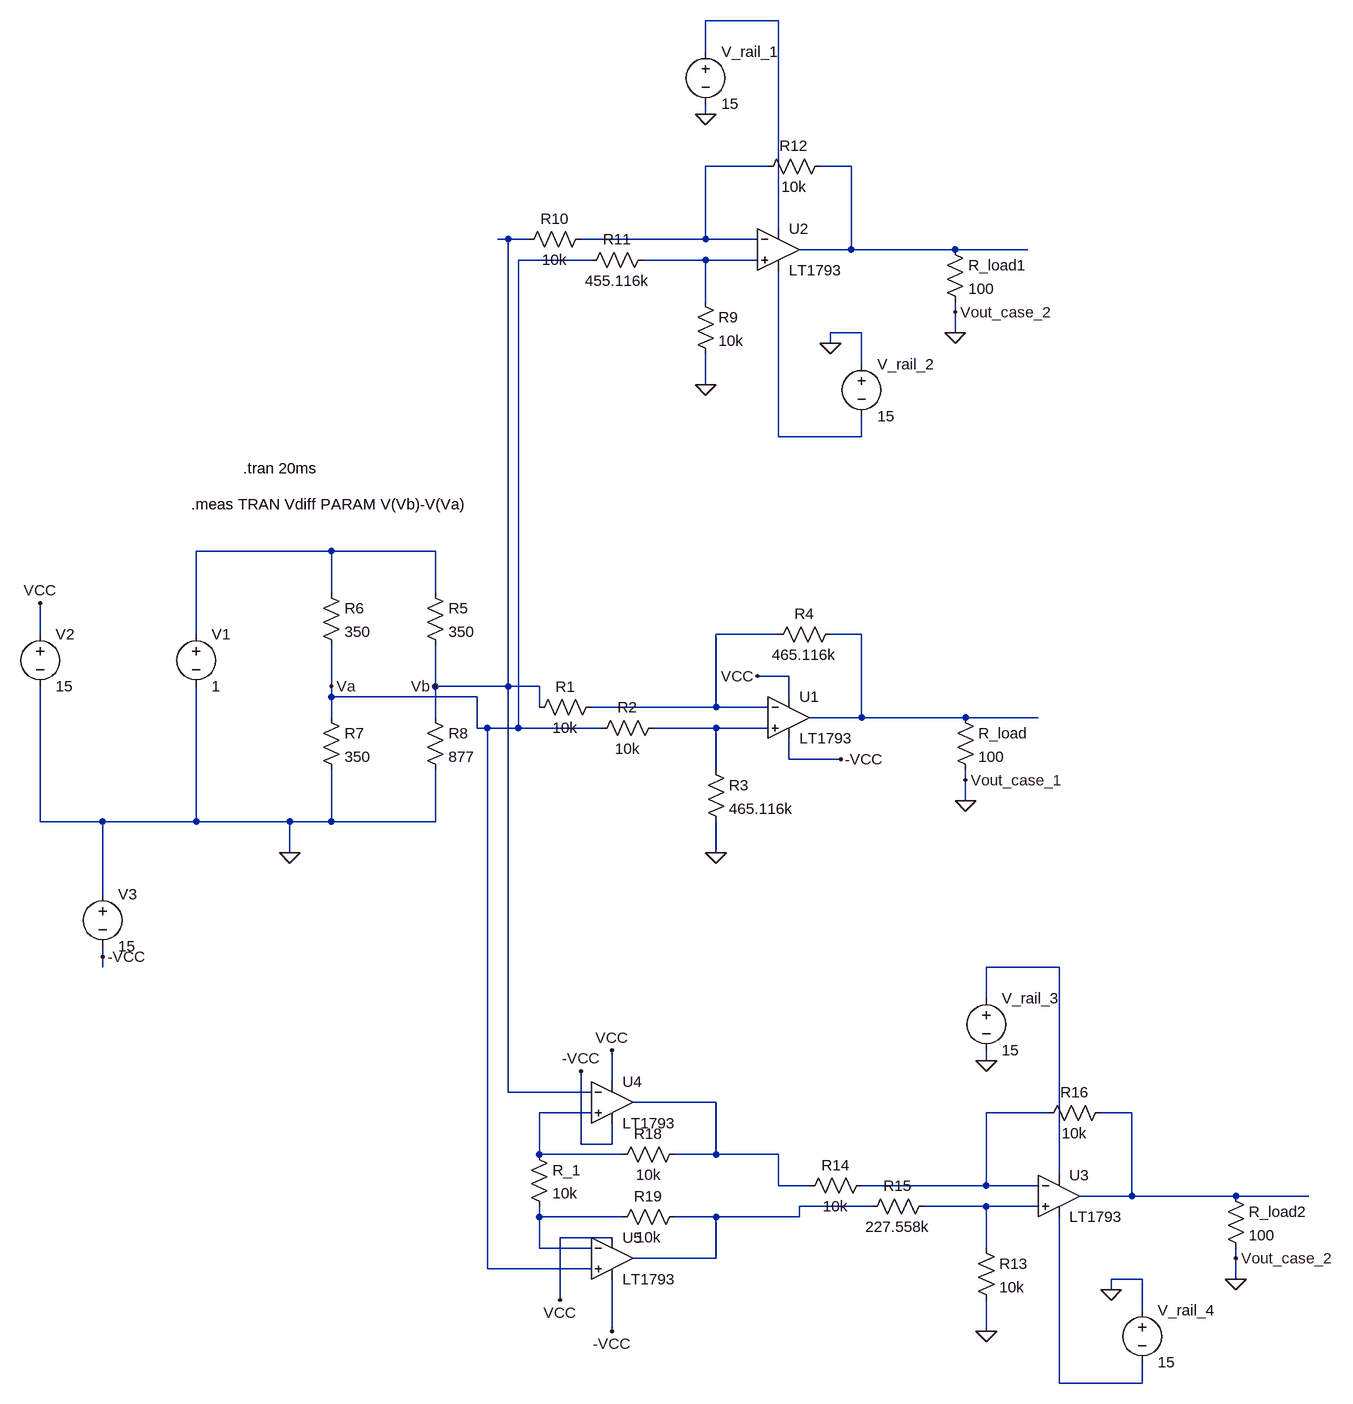
[diagram p0: schematic hw02_ece6140_B.asc]
hw02_ece6140_B.asc, the LTspice schematic file:
Version 4.1
SHEET 1 1000 1204
WIRE 176 -912 64 -912
WIRE 64 -864 64 -912
WIRE 64 -768 64 -784
WIRE 160 -688 64 -688
WIRE 288 -688 240 -688
WIRE 176 -592 176 -912
WIRE -240 -576 -256 -576
WIRE -208 -576 -240 -576
WIRE 64 -576 64 -688
WIRE 64 -576 -128 -576
WIRE 144 -576 64 -576
WIRE 288 -560 288 -688
WIRE 288 -560 208 -560
WIRE 448 -560 288 -560
WIRE 560 -560 448 -560
WIRE -112 -544 -224 -544
WIRE 64 -544 -32 -544
WIRE 144 -544 64 -544
WIRE 64 -480 64 -544
WIRE 448 -464 448 -480
WIRE 304 -432 256 -432
WIRE 448 -432 448 -464
WIRE 256 -416 256 -432
WIRE 304 -384 304 -432
WIRE 64 -352 64 -400
WIRE 176 -272 176 -528
WIRE 304 -272 304 -304
WIRE 304 -272 176 -272
WIRE -512 -96 -720 -96
WIRE -352 -96 -512 -96
WIRE -512 -32 -512 -96
WIRE -352 -32 -352 -96
WIRE -960 32 -960 -16
WIRE -720 32 -720 -96
WIRE 176 32 80 32
WIRE 304 32 256 32
WIRE 192 96 144 96
WIRE -512 112 -512 48
WIRE -352 112 -352 48
WIRE -240 112 -240 -576
WIRE -240 112 -352 112
WIRE -192 112 -240 112
WIRE -512 128 -512 112
WIRE -288 128 -512 128
WIRE 192 128 192 96
WIRE -192 144 -192 112
WIRE 80 144 80 32
WIRE 80 144 -112 144
WIRE 160 144 80 144
WIRE -512 160 -512 128
WIRE -352 160 -352 112
WIRE 304 160 304 32
WIRE 304 160 224 160
WIRE 464 160 304 160
WIRE 576 160 464 160
WIRE -288 176 -288 128
WIRE -272 176 -288 176
WIRE -224 176 -224 -544
WIRE -224 176 -272 176
WIRE -96 176 -224 176
WIRE 80 176 -16 176
WIRE 160 176 80 176
WIRE 192 224 192 192
WIRE 272 224 192 224
WIRE 80 240 80 176
WIRE 464 256 464 240
WIRE 464 288 464 256
WIRE -960 320 -960 112
WIRE -864 320 -960 320
WIRE -720 320 -720 112
WIRE -720 320 -864 320
WIRE -576 320 -720 320
WIRE -512 320 -512 240
WIRE -512 320 -576 320
WIRE -352 320 -352 240
WIRE -352 320 -512 320
WIRE -576 368 -576 320
WIRE 80 368 80 320
WIRE -864 432 -864 320
WIRE -864 528 -864 512
WIRE -864 544 -864 528
WIRE 608 544 496 544
WIRE 496 592 496 544
WIRE 496 688 496 672
WIRE -80 720 -80 672
WIRE -240 736 -240 112
WIRE -112 736 -240 736
WIRE 80 752 -48 752
WIRE -112 768 -192 768
WIRE 592 768 496 768
WIRE 720 768 672 768
WIRE -128 816 -128 704
WIRE -80 816 -80 784
WIRE -80 816 -128 816
WIRE -192 832 -192 768
WIRE -64 832 -192 832
WIRE 80 832 80 752
WIRE 80 832 16 832
WIRE 176 832 80 832
WIRE 608 864 608 544
WIRE 176 880 176 832
WIRE 224 880 176 880
WIRE 496 880 496 768
WIRE 496 880 304 880
WIRE 576 880 496 880
WIRE 720 896 720 768
WIRE 720 896 640 896
WIRE 880 896 720 896
WIRE 992 896 880 896
WIRE 320 912 208 912
WIRE 496 912 400 912
WIRE 576 912 496 912
WIRE -192 928 -192 912
WIRE -64 928 -192 928
WIRE 80 928 16 928
WIRE 208 928 208 912
WIRE 208 928 80 928
WIRE -80 960 -160 960
WIRE -192 976 -192 928
WIRE -112 976 -192 976
WIRE 496 976 496 912
WIRE 80 992 80 928
WIRE 80 992 -48 992
WIRE 880 992 880 976
WIRE -272 1008 -272 176
WIRE -112 1008 -272 1008
WIRE 736 1024 688 1024
WIRE 880 1024 880 992
WIRE 688 1040 688 1024
WIRE -160 1056 -160 960
WIRE 736 1072 736 1024
WIRE -80 1104 -80 1024
WIRE 496 1104 496 1056
WIRE 608 1184 608 928
WIRE 736 1184 736 1152
WIRE 736 1184 608 1184
FLAG 80 368 0
FLAG 464 288 0
FLAG -576 368 0
FLAG -512 112 Va
FLAG -352 112 Vb
FLAG 64 -352 0
FLAG 64 -768 0
FLAG 256 -416 0
FLAG 448 -432 0
FLAG 464 256 Vout_case_1
FLAG 448 -464 Vout_case_2
FLAG 496 1104 0
FLAG 496 688 0
FLAG 688 1040 0
FLAG 880 1024 0
FLAG 880 992 Vout_case_2
FLAG -960 -16 VCC
FLAG -80 672 VCC
FLAG -864 528 -VCC
FLAG 144 96 VCC
FLAG 272 224 -VCC
FLAG -160 1056 VCC
FLAG -128 704 -VCC
FLAG -80 1104 -VCC
SYMBOL OpAmps\\LT1793 192 96 R0
SYMATTR InstName U1
SYMBOL res 64 224 R0
SYMATTR InstName R3
SYMATTR Value 465.116k
SYMBOL res -96 128 R90
WINDOW 0 0 56 VBottom 2
WINDOW 3 32 56 VTop 2
SYMATTR InstName R1
SYMATTR Value 10k
SYMBOL res 0 160 R90
WINDOW 0 0 56 VBottom 2
WINDOW 3 32 56 VTop 2
SYMATTR InstName R2
SYMATTR Value 10k
SYMBOL res 272 16 R90
WINDOW 0 0 56 VBottom 2
WINDOW 3 32 56 VTop 2
SYMATTR InstName R4
SYMATTR Value 465.116k
SYMBOL res 448 144 R0
SYMATTR InstName R_load
SYMATTR Value 100
SYMBOL res -368 -48 R0
SYMATTR InstName R5
SYMATTR Value 350
SYMBOL res -528 -48 R0
SYMATTR InstName R6
SYMATTR Value 350
SYMBOL res -528 144 R0
SYMATTR InstName R7
SYMATTR Value 350
SYMBOL res -368 144 R0
SYMATTR InstName R8
SYMATTR Value 877
SYMBOL voltage -720 16 R0
WINDOW 123 0 0 Left 0
WINDOW 39 0 0 Left 0
SYMATTR InstName V1
SYMATTR Value 1
SYMBOL OpAmps\\LT1793 176 -624 R0
SYMATTR InstName U2
SYMBOL res 48 -496 R0
SYMATTR InstName R9
SYMATTR Value 10k
SYMBOL res -112 -592 R90
WINDOW 0 0 56 VBottom 2
WINDOW 3 32 56 VTop 2
SYMATTR InstName R10
SYMATTR Value 10k
SYMBOL res -16 -560 R90
WINDOW 0 0 56 VBottom 2
WINDOW 3 32 56 VTop 2
SYMATTR InstName R11
SYMATTR Value 455.116k
SYMBOL res 256 -704 R90
WINDOW 0 0 56 VBottom 2
WINDOW 3 32 56 VTop 2
SYMATTR InstName R12
SYMATTR Value 10k
SYMBOL voltage 64 -880 R0
SYMATTR InstName V_rail_1
SYMATTR Value 15
SYMBOL voltage 304 -400 R0
WINDOW 123 0 0 Left 0
WINDOW 39 0 0 Left 0
SYMATTR InstName V_rail_2
SYMATTR Value 15
SYMBOL res 432 -576 R0
SYMATTR InstName R_load1
SYMATTR Value 100
SYMBOL OpAmps\\LT1793 608 832 R0
SYMATTR InstName U3
SYMBOL res 480 960 R0
SYMATTR InstName R13
SYMATTR Value 10k
SYMBOL res 320 864 R90
WINDOW 0 0 56 VBottom 2
WINDOW 3 32 56 VTop 2
SYMATTR InstName R14
SYMATTR Value 10k
SYMBOL res 416 896 R90
WINDOW 0 0 56 VBottom 2
WINDOW 3 32 56 VTop 2
SYMATTR InstName R15
SYMATTR Value 227.558k
SYMBOL res 688 752 R90
WINDOW 0 0 56 VBottom 2
WINDOW 3 32 56 VTop 2
SYMATTR InstName R16
SYMATTR Value 10k
SYMBOL voltage 496 576 R0
SYMATTR InstName V_rail_3
SYMATTR Value 15
SYMBOL voltage 736 1056 R0
WINDOW 123 0 0 Left 0
WINDOW 39 0 0 Left 0
SYMATTR InstName V_rail_4
SYMATTR Value 15
SYMBOL res 864 880 R0
SYMATTR InstName R_load2
SYMATTR Value 100
SYMBOL OpAmps\\LT1793 -80 688 R0
SYMATTR InstName U4
SYMBOL OpAmps\\LT1793 -80 928 R0
SYMATTR InstName U5
SYMBOL res -208 816 R0
SYMATTR InstName R_1
SYMATTR Value 10k
SYMBOL res 32 816 R90
WINDOW 0 0 56 VBottom 2
WINDOW 3 32 56 VTop 2
SYMATTR InstName R18
SYMATTR Value 10k
SYMBOL res 32 912 R90
WINDOW 0 0 56 VBottom 2
WINDOW 3 32 56 VTop 2
SYMATTR InstName R19
SYMATTR Value 10k
SYMBOL voltage -960 16 R0
WINDOW 123 0 0 Left 0
WINDOW 39 0 0 Left 0
SYMATTR InstName V2
SYMATTR Value 15
SYMBOL voltage -864 416 R0
WINDOW 123 0 0 Left 0
WINDOW 39 0 0 Left 0
SYMATTR InstName V3
SYMATTR Value 15
TEXT -648 -224 Left 2 !.tran 20ms
TEXT -728 -168 Left 2 !.meas TRAN Vdiff PARAM V(Vb)-V(Va)

The netlist it stands for:
* hw02_ece6140_B.asc
X§U1 N009 N007 VCC -VCC N008 LT1793  ; pins In+ In- V+ V- OUT
R3 N009 0 465.116k
R1 N007 Vb 10k
R2 N009 Va 10k
R4 N008 N007 465.116k
R_load N008 0 100
R5 N006 Vb 350
R6 N006 Va 350
R7 Va 0 350
R8 Vb 0 877
V1 N006 0 1
X§U2 N004 N002 N001 N005 N003 LT1793  ; pins In+ In- V+ V- OUT
R9 N004 0 10k
R10 N002 Vb 10k
R11 N004 Va 455.116k
R12 N003 N002 10k
V_rail_1 N001 0 15
V_rail_2 0 N005 15
R_load1 N003 0 100
X§U3 N016 N013 N010 N018 N014 LT1793  ; pins In+ In- V+ V- OUT
R13 N016 0 10k
R14 N013 N011 10k
R15 N016 N015 227.558k
R16 N014 N013 10k
V_rail_3 N010 0 15
V_rail_4 0 N018 15
R_load2 N014 0 100
X§U4 N012 Vb VCC -VCC N011 LT1793  ; pins In+ In- V+ V- OUT
X§U5 Va N017 VCC -VCC N015 LT1793  ; pins In+ In- V+ V- OUT
R_1 N012 N017 10k
R18 N011 N012 10k
R19 N015 N017 10k
V2 VCC 0 15
V3 0 -VCC 15
.tran 20ms
.meas TRAN Vdiff PARAM V(Vb)-V(Va)
.lib LTC.lib
.backanno
.end